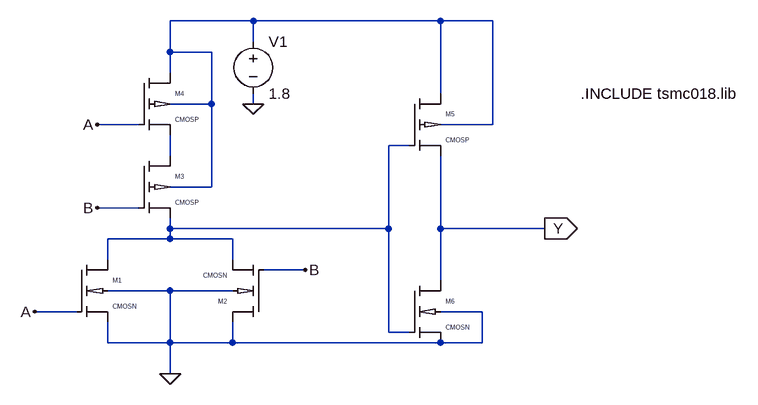
[diagram p0: schematic OR.asc]
OR.asc, the LTspice schematic file:
Version 4
SHEET 1 1052 680
WIRE 288 -208 160 -208
WIRE 576 -208 288 -208
WIRE 656 -208 576 -208
WIRE 288 -176 288 -208
WIRE 160 -160 160 -208
WIRE 224 -160 160 -160
WIRE 160 -128 160 -160
WIRE 576 -96 576 -208
WIRE 224 -80 224 -160
WIRE 224 -80 160 -80
WIRE 288 -80 288 -96
WIRE 112 -48 48 -48
WIRE 656 -48 656 -208
WIRE 656 -48 576 -48
WIRE 528 -16 496 -16
WIRE 160 0 160 -32
WIRE 224 48 224 -80
WIRE 224 48 160 48
WIRE 112 80 48 80
WIRE 160 112 160 96
WIRE 496 112 496 -16
WIRE 496 112 160 112
WIRE 576 112 576 0
WIRE 736 112 576 112
WIRE 160 128 160 112
WIRE 160 128 64 128
WIRE 256 128 160 128
WIRE 64 160 64 128
WIRE 256 160 256 128
WIRE 368 176 304 176
WIRE 576 192 576 112
WIRE 160 208 64 208
WIRE 256 208 160 208
WIRE 16 240 -48 240
WIRE 640 240 576 240
WIRE 496 272 496 112
WIRE 528 272 496 272
WIRE 64 288 64 256
WIRE 160 288 160 208
WIRE 160 288 64 288
WIRE 256 288 256 256
WIRE 256 288 160 288
WIRE 576 288 256 288
WIRE 640 288 640 240
WIRE 640 288 576 288
WIRE 160 336 160 288
FLAG 160 336 0
FLAG 288 -80 0
FLAG 48 -48 A
FLAG -48 240 A
FLAG 48 80 B
FLAG 368 176 B
FLAG 736 112 Y
IOPIN 736 112 Out
SYMBOL Ncmos 16 160 R0
SYMATTR InstName M1
SYMATTR Value2 l=180n w=360n
SYMBOL Ncmos 304 256 R180
SYMATTR InstName M2
SYMATTR Value2 l=180n w=360n
SYMBOL Pcmos 112 0 R0
SYMATTR InstName M3
SYMATTR Value2 l=180n w=360n
SYMBOL Pcmos 112 -128 R0
SYMATTR InstName M4
SYMATTR Value2 l=180n w=360n
SYMBOL voltage 288 -192 R0
WINDOW 123 0 0 Left 0
WINDOW 39 0 0 Left 0
SYMATTR InstName V1
SYMATTR Value 1.8
SYMBOL Pcmos 528 -96 R0
SYMATTR InstName M5
SYMATTR Value2 l=180n w=360n
SYMBOL Ncmos 528 192 R0
SYMATTR InstName M6
SYMATTR Value2 l=180n w=360n
TEXT 792 -96 Left 2 !.INCLUDE tsmc018.lib

The netlist it stands for:
* OR.asc
M1 N002 A 0 0 CMOSN l=180n w=360n
M2 0 B N002 0 CMOSN l=180n w=360n
M3 N003 B N002 N001 CMOSP l=180n w=360n
M4 N001 A N003 N001 CMOSP l=180n w=360n
V1 N001 0 1.8
M5 N001 N002 Y N001 CMOSP l=180n w=360n
M6 Y N002 0 0 CMOSN l=180n w=360n
.model NMOS NMOS
.model PMOS PMOS
.lib standard.mos
.INCLUDE tsmc018.lib
.lib tsmc018.lib
.backanno
.end